# EAGLE design MainBoard (EAGLE 9.6.2)

## Sheet 1 of 2
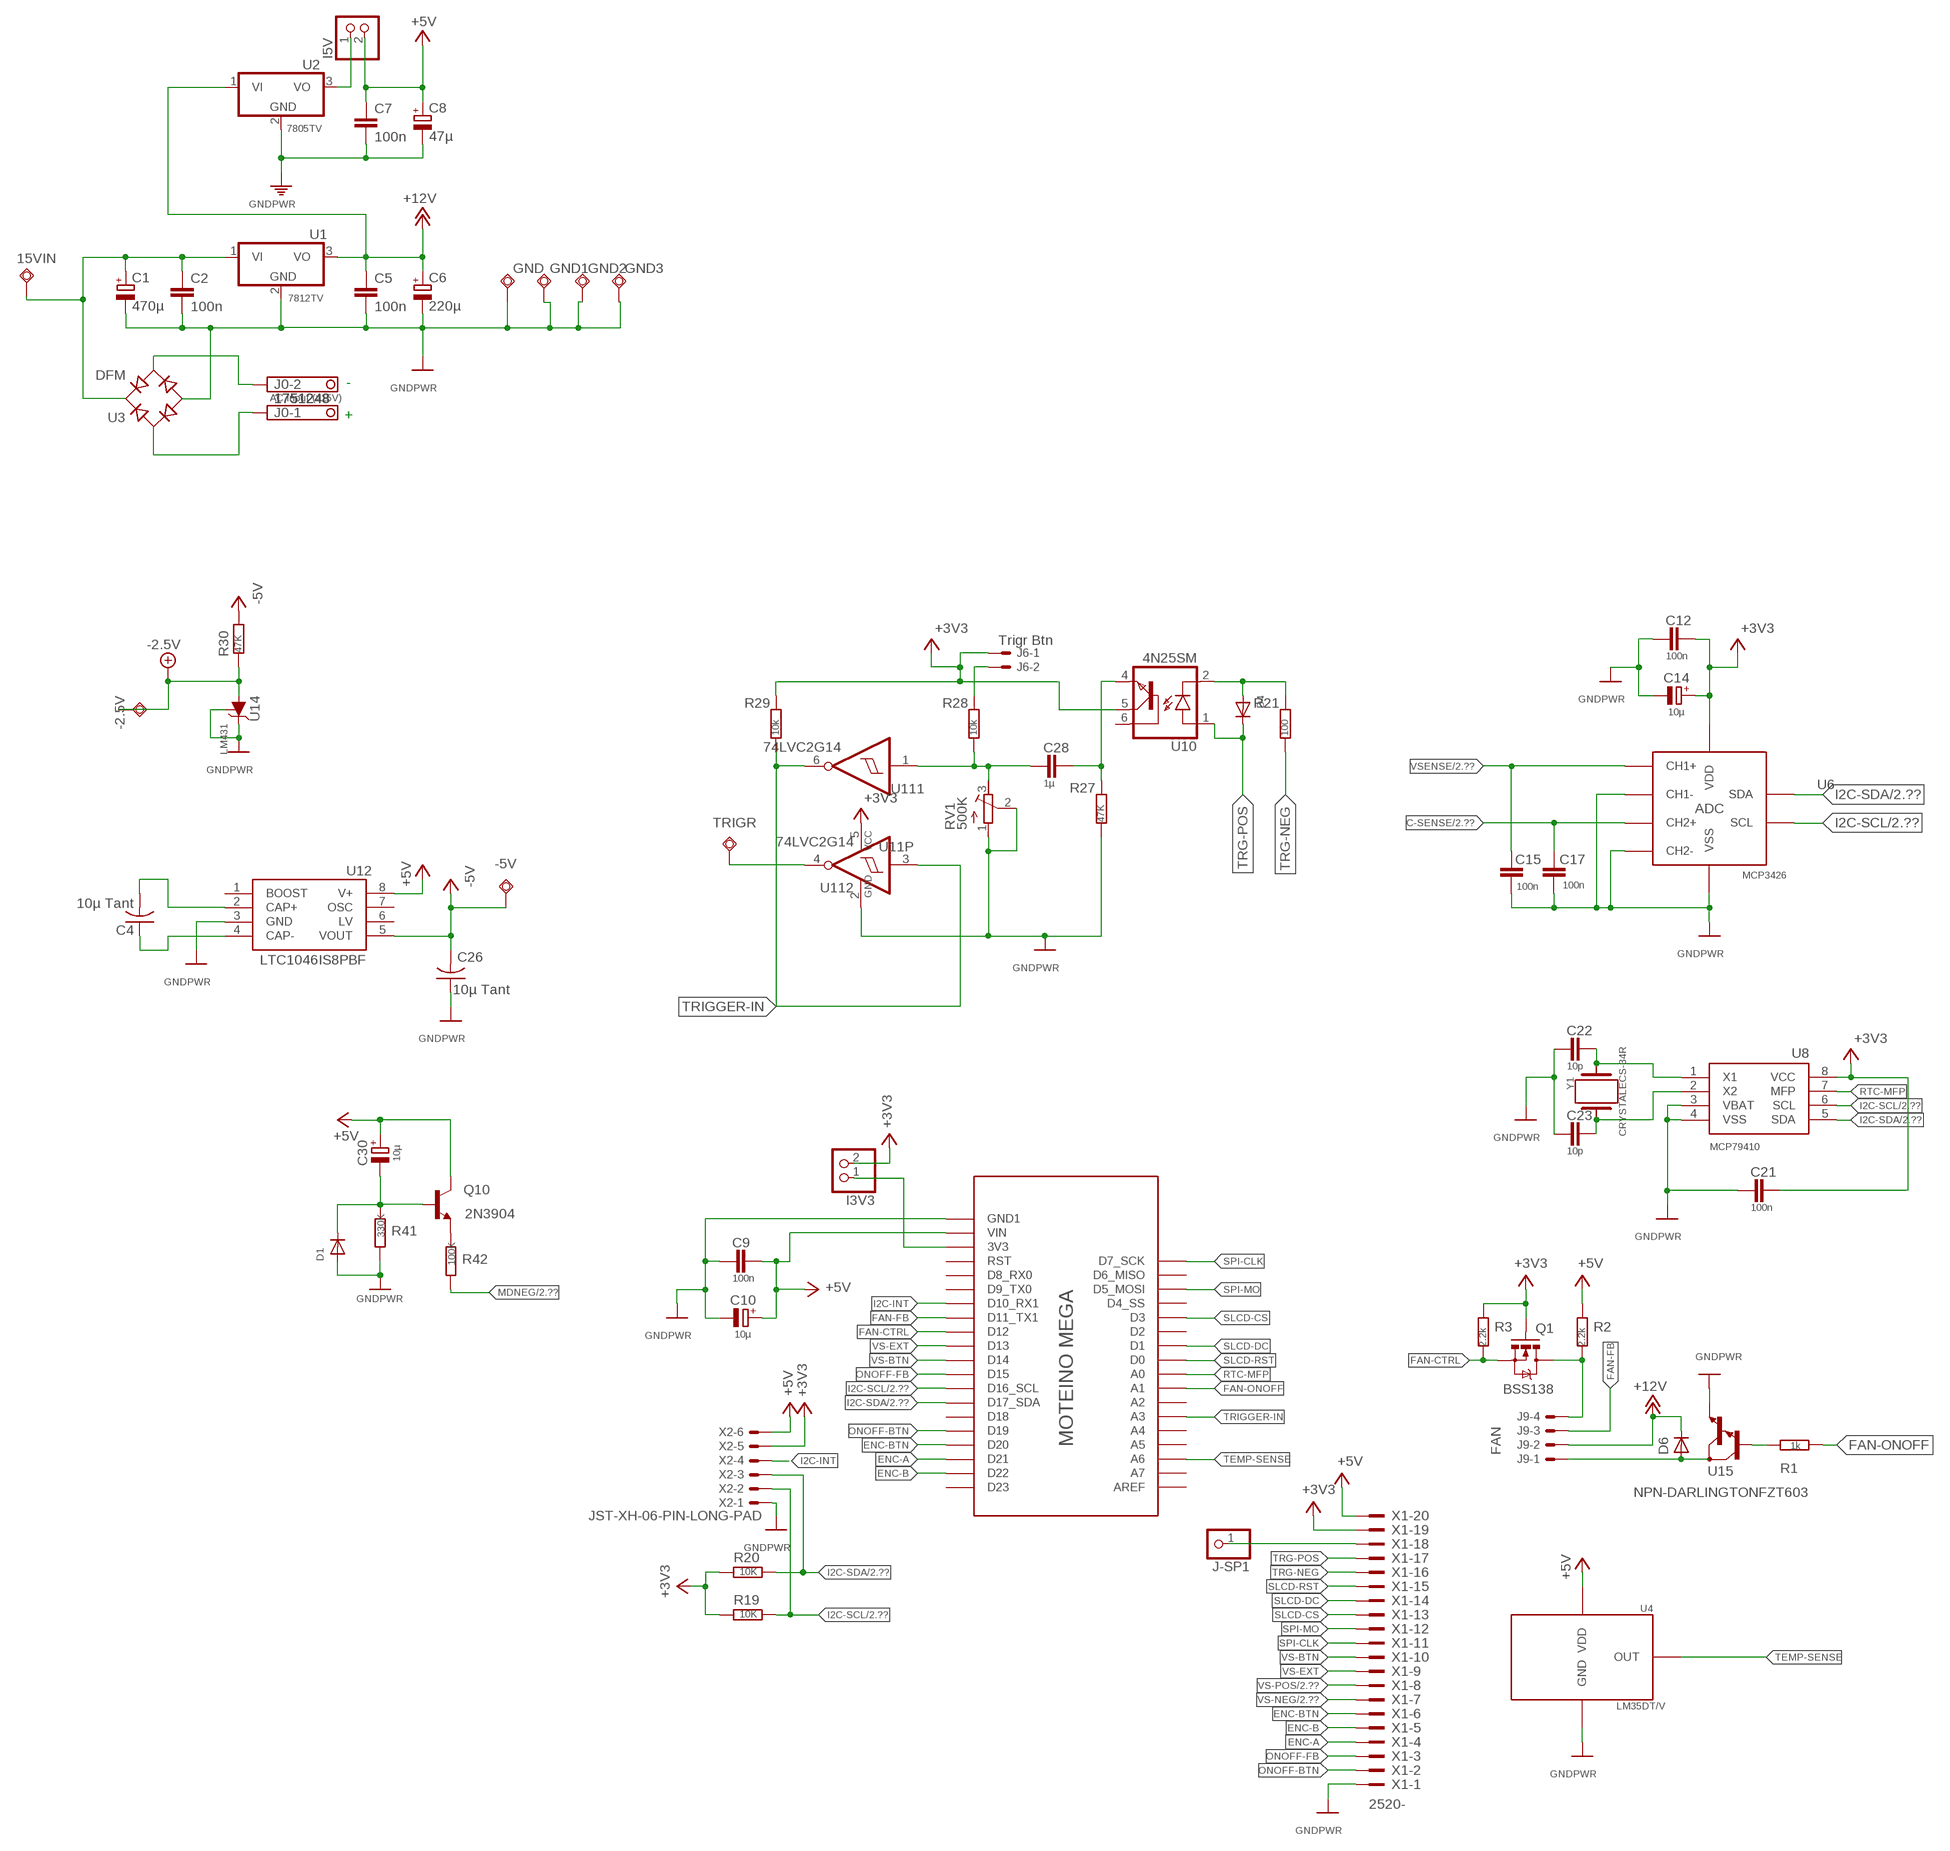
[diagram p0: schematic, sheet 1]

### Parts
15VIN  TEST-POINT4952  [TP-KEYSTONE-4952]
-2.5V  TEST-POINT4952  [TP-KEYSTONE-4952]
-5V  TEST-POINT4952  [TP-KEYSTONE-4952]
C1  470µ  CPOL-EUE5-10.5  [E5-10,5]
C2  100n  C-EUC0805K  [C0805K]
C4  10µ Tant  C-USC1210  [C1210]
C5  100n  C-EUC0805K  [C0805K]
C6  220µ  CPOL-EUE5-10.5  [E5-10,5]
C7  100n  C-EUC0805K  [C0805K]
C8  47µ  CPOL-EUE5-5  [E5-5]
C9  100n  C-EUC0805K  [C0805K]
C10  10µ  CPOL-EUE2-5  [E2-5]
C12  100n  C-EUC0805K  [C0805K]
C14  10µ  CPOL-EUE2-5  [E2-5]
C15  100n  C-EUC0805K  [C0805K]
C17  100n  C-EUC0805K  [C0805K]
C21  100n  C-EUC0805K  [C0805K]
C22  10p  C-EUC0805K  [C0805K]
C23  10p  C-EUC0805K  [C0805K]
C26  10µ Tant  C-USC1210  [C1210]
C28  1µ  C-EUC0805K  [C0805K]
C30  10µ  CPOL-EUE2-5  [E2-5]
D1  DIODESOD-323F  [SOD-323F]
D4  DIODESOD-323F  [SOD-323F]
D6  DIODE_SOD-123FL  [SOD-123FL]
GND  TEST-POINT4952  [TP-KEYSTONE-4952]
GND1  TEST-POINT4952  [TP-KEYSTONE-4952]
GND2  TEST-POINT4952  [TP-KEYSTONE-4952]
GND3  TEST-POINT4952  [TP-KEYSTONE-4952]
I3V3  PINHD-1X2  [1X02]
I5V  PINHD-1X2  [1X02]
J0  1751248  [1751248]
J6  Trigr Btn  JST-XH-02-PIN-ROUND-PAD  [JST-XH-02-PACKAGE-ROUND-PAD]
J9  FAN  JST-XH-04-PIN-ROUND-PAD  [JST-XH-04-PACKAGE-ROUND-PAD]
J-SP1  PINHD-1X1  [1X01]
Q1  BSS138  MOSFET-NCHANNELBSS138  [SOT23]
Q10  2N3904  [TO92]
R1  1k  R-EU_R0805  [R0805]
R2  2.2k  R-EU_R0805  [R0805]
R3  2.2k  R-EU_R0805  [R0805]
R19  10K  R-EU_R0805  [R0805]
R20  10K  R-EU_R0805  [R0805]
R21  100  R-EU_R0805  [R0805]
R27  47K  R-EU_R0805  [R0805]
R28  10k  R-EU_R0805  [R0805]
R29  10k  R-EU_R0805  [R0805]
R30  47K  R-EU_R0805  [R0805]
R41  330K  R-EU_R0805  [R0805]
R42  100K  R-EU_R0805  [R0805]
RV1  500K  R-TRIMM3296W  [RTRIM3296W]
TRIGR  TEST-POINT4952  [TP-KEYSTONE-4952]
U1  7812TV  [TO220V]
U2  7805TV  [TO220V]
U3  DFM  [DFM]
U4  LM35DT/V  [TO220V]
U6  MCP3426  [SO8]
U8  MCP79410  MCP79410-I_SN  [SOIC127P600X175-8N]
U10  4N25SM  [DIL6-SMD]
U11  74LVC2G14  [SOT23-6]
U12  LTC1046IS8PBF  [SOIC127P599X175-8N]
U14  LM431  [SOT23]
U15  NPN-DARLINGTONFZT603  [SOT223]
U$1  MOTEINO_MEGA_SIMPLE  [MOTEINO_MEGA_SIMPLE]
X1  2520-  [PAK100/2500-20]
X2  JST-XH-06-PIN-LONG-PAD  [JST-XH-06-PACKAGE-LONG-PAD]
Y1  CRYSTALECS-34R  [ECS32712534RRTR]

### Nets
+3V3: C12.1 C14.+ C21.1 I3V3.2 J6.1 Q1.1(G) R3.2 R19.2 R20.2 R29.2 U6.3(VDD) U8.8(VCC) U10.5(COL) U11.5(P:VCC) X1.19 X2.5
+5V: C7.1 C8.+ C9.1 C10.+ C30.+ I5V.2 Q10.1(C) R2.2 U4.1(VDD) U12.8(V+) U$1.VIN U$1.VIN_2(VIN) X1.20 X2.6 ; also sheet 2
+12V [Fan]: C5.1 C6.+ D6.C J9.2 U1.3(VO) U2.1(VI)
-2.5V: -2.5V.P$1(TP) R30.1 U14.3(A) ; also sheet 2
-5V: -5V.P$1(TP) C26.2 R30.2 U12.5(VOUT) ; also sheet 2
C-SENSE: C17.2 U6.7(CH2+) ; also sheet 2
ENC-A: U$1.D21 X1.4
ENC-B: U$1.D22 X1.5
ENC-BTN: U$1.D20 X1.6
FAN-CTRL: Q1.2(S) R3.1 U$1.D12
FAN-CTRL-5V: J9.4 Q1.3(D) R2.1
FAN-FB: J9.3 U$1.D11(D11_TX1)
FAN-ONOFF: R1.1 U$1.A1
GND: C1.- C2.2 C5.2 C6.- C7.2 C8.- C9.2 C10.- C12.2 C14.- C15.2 C17.1 C21.2 C22.2 C23.2 C26.1 D1.A GND1.P$1(TP) GND2.P$1(TP) GND3.P$1(TP) GND.P$1(TP) R27.1 R41.2 RV1.1(A) RV1.2(S) U1.2(GND) U2.2(GND) U3.- U4.2(GND) U6.2(CH1-) U6.6(VSS) U6.8(CH2-) U8.3(VBAT) U8.4(VSS) U11.2(P:GND) U12.3(GND) U14.1(C) U14.2(ADJ) U15.3(E) U$1.GND1 U$1.GND_2(GND1) X1.1 X2.1 ; supply symbol labelled GNDPWR ; also sheet 2
I2C-INT: U$1.D10(D10_RX1) X2.4
I2C-SCL: R19.1 U6.5(SCL) U8.6(SCL) U$1.D16(D16_SCL) X2.2 ; also sheet 2
I2C-SDA: R20.1 U6.4(SDA) U8.5(SDA) U$1.D17(D17_SDA) X2.3 ; also sheet 2
MDNEG: R42.2 ; also sheet 2
N$1: TRIGR.P$1(TP) U11.4(2:O)
N$2: D6.A J9.1 U15.2(C) U15.4(C)
N$3: I5V.1 U2.3(VO)
N$4: I3V3.1 U$1.3V3 U$1.3V3_2(3V3)
N$5: 15VIN.P$1(TP) C1.+ C2.1 U1.1(VI) U3.+
N$6: J0.1 U3.A1(AC1)
N$9: J0.2 U3.A2(AC2)
N$22: C4.2 U12.2(CAP+)
N$23: J-SP1.1 X1.18
N$24: C4.1 U12.4(CAP-)
N$27: C28.2 R28.1 RV1.3(E) U11.1(1:I)
N$28: C28.1 R27.2 U10.4(EMI)
N$29: D4.A R21.2 U10.2(C)
N$35: J6.2 R28.2
N$62: Q10.3(E) R42.1
N$63: C30.- D1.C Q10.2(B) R41.1
ONOFF-BTN: U$1.D19 X1.2
ONOFF-FB: U$1.D15 X1.3
RTC-MFP: U8.7(MFP) U$1.A0
RTCX1: C22.1 U8.1(X1) Y1.1
RTCX2: C23.1 U8.2(X2) Y1.2
SLCD-CS: U$1.D3 X1.13
SLCD-DC: U$1.D1 X1.14
SLCD-RST: U$1.D0 X1.15
SPI-CLK: U$1.D7(D7_SCK) X1.11
SPI-MO: U$1.D5(D5_MOSI) X1.12
TEMP-SENSE: U4.3(OUT) U$1.A6
TRG-NEG: R21.1 X1.16
TRG-POS: D4.C U10.1(A) X1.17
TRIGGER-IN: R29.1 U11.3(2:I) U11.6(1:O) U$1.A3
U15IN: R1.2 U15.1(B)
VS-BTN: U$1.D14 X1.10
VS-EXT: U$1.D13 X1.9
VS-NEG: X1.7 ; also sheet 2
VS-POS: X1.8 ; also sheet 2
VSENSE: C15.1 U6.1(CH1+) ; also sheet 2
Unconnected: U10.6(BAS) U12.1(BOOST) U12.6(LV) U12.7(OSC) U$1.A2 U$1.A4 U$1.A5 U$1.A7 U$1.AREF U$1.D2 U$1.D4(D4_SS) U$1.D6(D6_MISO) U$1.D8(D8_RX0) U$1.D9(D9_TX0) U$1.D18 U$1.D23 U$1.RST

### Notes on the sheet
- -
- AC Input (>15V)
- +

## Sheet 2 of 2
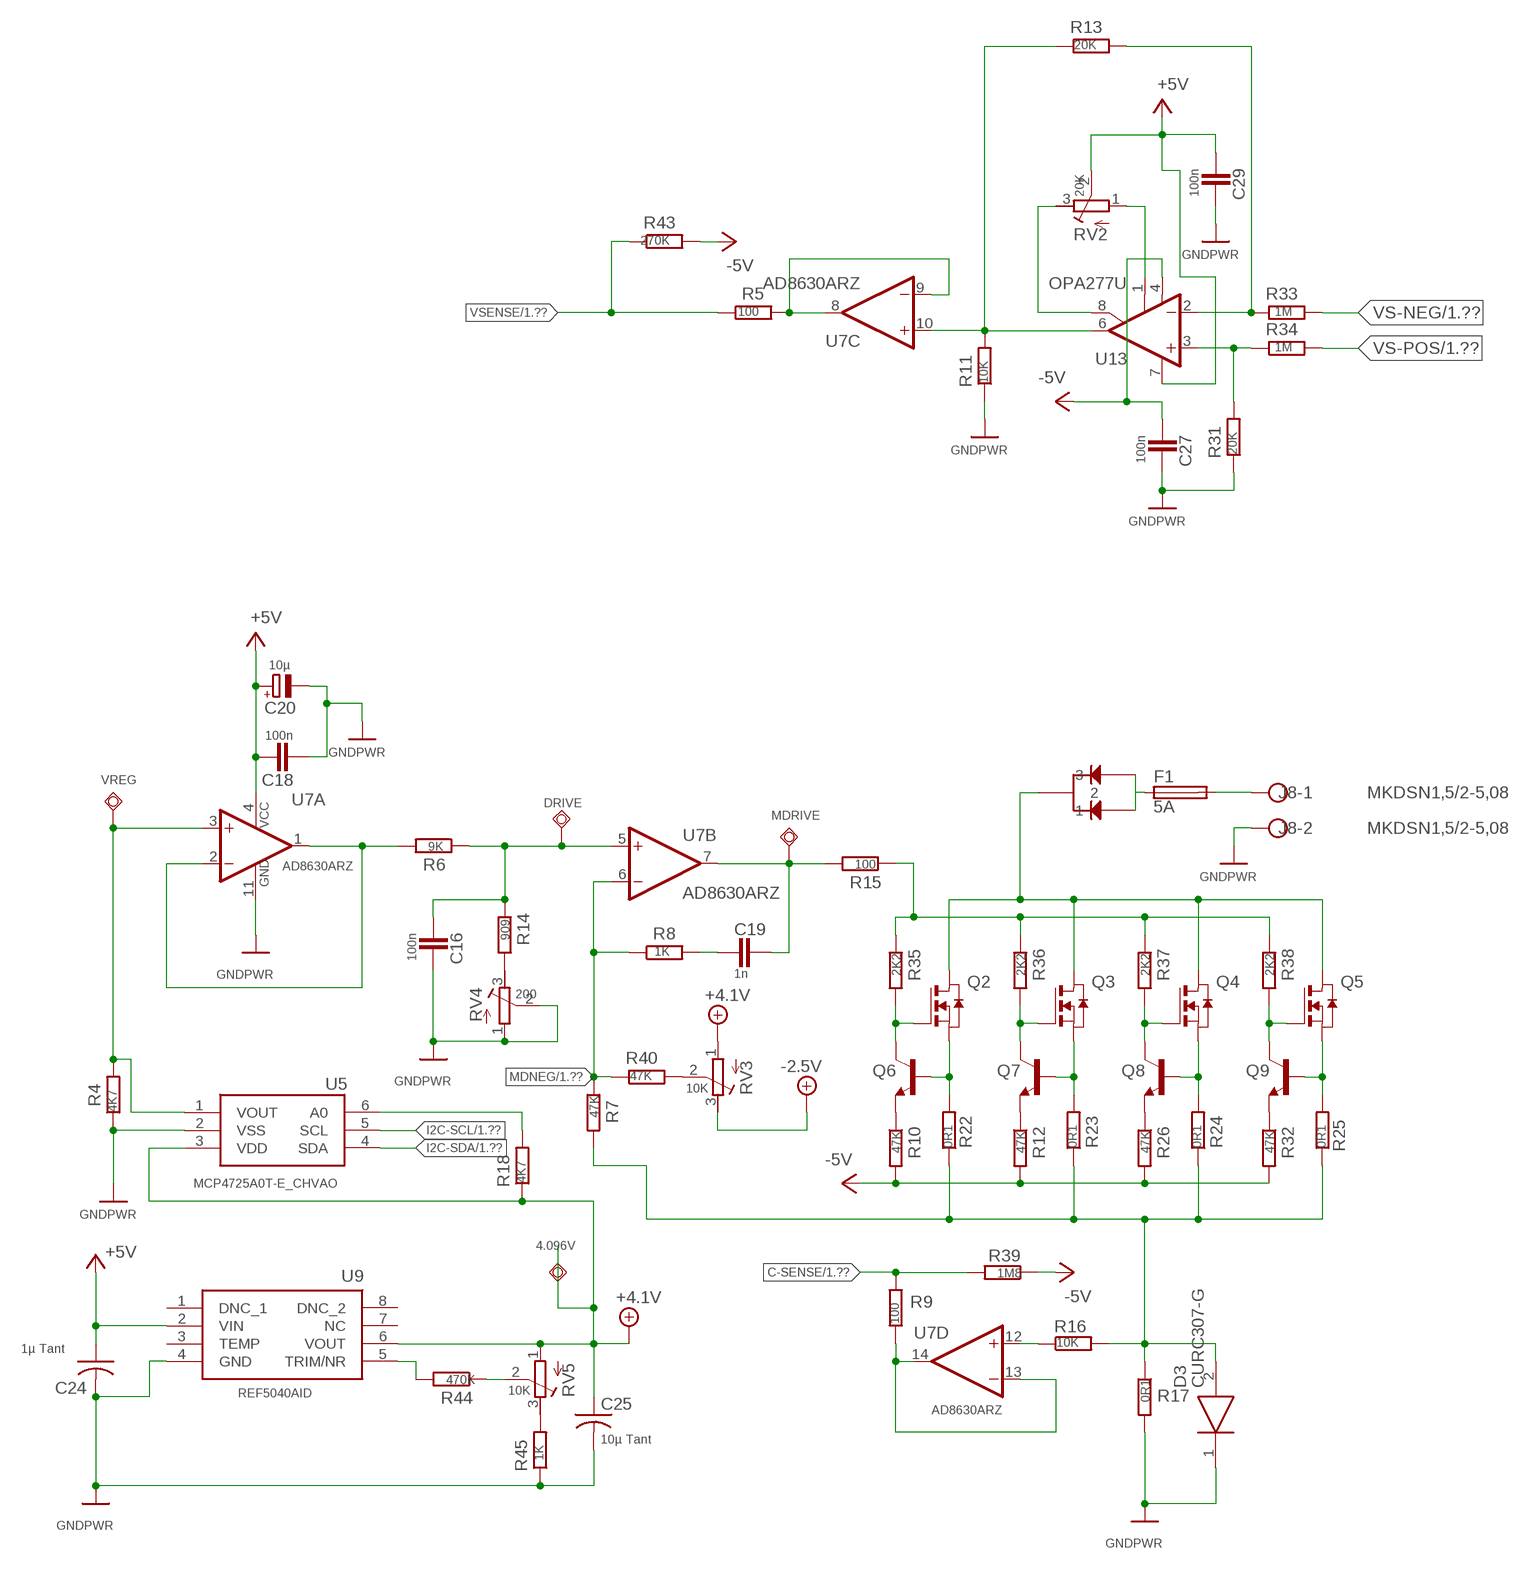
[diagram p1: schematic, sheet 2]

### Parts
4.096V  TEST-POINT4952  [TP-KEYSTONE-4952]
C16  100n  C-EUC0805K  [C0805K]
C18  100n  C-EUC0805K  [C0805K]
C19  1n  C-EUC0805K  [C0805K]
C20  10µ  CPOL-EUE2-5  [E2-5]
C24  1µ Tant  C-USC1210  [C1210]
C25  10µ Tant  C-USC1210  [C1210]
C27  100n  C-EUC0805K  [C0805K]
C29  100n  C-EUC0805K  [C0805K]
D3  CURC307-G  [DIOM7959X262N]
D5  MBR41H100CT/V  [TO220-VERT]
DRIVE  TEST-POINT4952  [TP-KEYSTONE-4952]
F1  5A  SHK20L  [SHK20L]
J8  MKDSN1,5/2-5,08  [MKDSN1,5/2-5,08]
MDRIVE  TEST-POINT4952  [TP-KEYSTONE-4952]
Q2  SUP70040E/V  [TO220-VERT]
Q3  SUP70040E/V  [TO220-VERT]
Q4  SUP70040E/V  [TO220-VERT]
Q5  SUP70040E/V  [TO220-VERT]
Q6  MPS2222A-NPN-TO92-CBE  [TO92-CBE]
Q7  MPS2222A-NPN-TO92-CBE  [TO92-CBE]
Q8  MPS2222A-NPN-TO92-CBE  [TO92-CBE]
Q9  MPS2222A-NPN-TO92-CBE  [TO92-CBE]
R4  4K7  R-EU_R0805  [R0805]
R5  100  R-EU_R0805  [R0805]
R6  9K  R-EU_R0805  [R0805]
R7  47K  R-EU_R0805  [R0805]
R8  1K  R-EU_R0805  [R0805]
R9  100  R-EU_R0805  [R0805]
R10  47K  R-EU_R0805  [R0805]
R11  10K  R-EU_R0805  [R0805]
R12  47K  R-EU_R0805  [R0805]
R13  20K  R-EU_R1206  [R1206]
R14  909  R-EU_R1206  [R1206]
R15  100  R-EU_R0805  [R0805]
R16  10K  R-EU_R0805  [R0805]
R17  0R1  PWR220T-35  [TO220-DPAC]
R18  4K7  R-EU_R0805  [R0805]
R22  0R1  RESISTOR0750V  [0750V]
R23  0R1  RESISTOR0750V  [0750V]
R24  0R1  RESISTOR0750V  [0750V]
R25  0R1  RESISTOR0750V  [0750V]
R26  47K  R-EU_R0805  [R0805]
R31  20K  R-EU_R1206  [R1206]
R32  47K  R-EU_R0805  [R0805]
R33  1M  R-EU_R1206  [R1206]
R34  1M  R-EU_R1206  [R1206]
R35  2K2  R-EU_R0805  [R0805]
R36  2K2  R-EU_R0805  [R0805]
R37  2K2  R-EU_R0805  [R0805]
R38  2K2  R-EU_R0805  [R0805]
R39  1M8  R-EU_R0805  [R0805]
R40  47K  R-EU_R1206  [R1206]
R43  270K  R-EU_R0805  [R0805]
R44  470K  R-EU_R0805  [R0805]
R45  1K  R-EU_R0805  [R0805]
RV2  20K  R-TRIMM3296W  [RTRIM3296W]
RV3  10K  R-TRIMM3296W  [RTRIM3296W]
RV4  200  R-TRIMM3296W  [RTRIM3296W]
RV5  10K  R-TRIMM3296W  [RTRIM3296W]
U5  MCP4725A0T-E_CHVAO  [SOT95P270X145-6N]
U7  AD8630ARZ  [SO14]
U9  REF5040AID  [SOIC127P600X175-8N]
U13  OPA277U  [SO08]
VREG  TEST-POINT4952  [TP-KEYSTONE-4952]

### Nets
+4.1V: 4.096V.P$1(TP) C25.1 R18.1 RV3.1(A) RV5.1(A) U5.3(VDD) U9.6(VOUT)
+5V: C18.1 C20.+ C24.1 C29.2 RV2.2(S) U7.4(P:VCC) U9.2(VIN) U13.7(V+) ; also sheet 1
-2.5V: RV3.3(E) ; also sheet 1
-5V: C27.2 R10.2 R12.2 R26.2 R32.2 R39.1 R43.2 U13.4(V-) ; also sheet 1
C-SENSE: R9.2 R39.2 ; also sheet 1
DACA0: R18.2 U5.6(A0)
DACVO: R4.2 U5.1(VOUT) U7.3(A:+IN) VREG.P$1(TP)
GND: C16.1 C18.2 C20.- C24.2 C25.2 C27.1 C29.1 D3.1(K) J8.2 R4.1 R11.1 R17.2 R31.1 R45.1 RV4.1(A) RV4.2(S) U5.2(VSS) U7.11(P:GND) U9.4(GND) ; supply symbol labelled GNDPWR ; also sheet 1
I2C-SCL: U5.5(SCL) ; also sheet 1
I2C-SDA: U5.4(SDA) ; also sheet 1
MDNEG: R7.1 R8.1 R40.1 U7.6(B:-IN) ; also sheet 1
N$7: R44.2 U9.5(TRIM/NR)
N$10: R45.2 RV5.3(E)
N$11: R44.1 RV5.2(S)
N$13: R6.2 U7.1(A:OUT) U7.2(A:-IN)
N$14: C16.2 DRIVE.P$1(TP) R6.1 R14.1 U7.5(B:+IN)
N$21: R13.2 R33.1 U13.2(-IN)
N$26: R14.2 RV4.3(E)
N$32: C19.1 MDRIVE.P$1(TP) R15.2 U7.7(B:OUT)
N$33: Q2.1(G) Q6.C R35.2
N$34: C19.2 R8.2
N$36: Q3.1(G) Q7.C R36.2
N$37: Q4.1(G) Q8.C R37.2
N$38: Q5.1(G) Q9.C R38.2
N$39: R15.1 R35.1 R36.1 R37.1 R38.1
N$40: Q6.E R10.1
N$41: Q7.E R12.1
N$42: Q8.E R26.1
N$43: Q2.3(S) Q6.B R22.2
N$44: Q9.E R32.1
N$45: Q3.3(S) Q7.B R23.2
N$46: Q4.3(S) Q8.B R24.2
N$47: Q5.3(S) Q9.B R25.2
N$48: R40.2 RV3.2(S)
N$49: D3.2(A) R7.2 R16.2 R17.1 R22.1 R23.1 R24.1 R25.1
N$50: D5.2 Q2.2(D) Q3.2(D) Q4.2(D) Q5.2(D)
N$51: R16.1 U7.12(D:+IN)
N$52: R9.1 U7.13(D:-IN) U7.14(D:OUT)
N$53: D5.1 D5.3 F1.1A F1.1B
N$54 [HightCurrent]: F1.2A F1.2B J8.1
N$55: R31.2 R34.1 U13.3(+IN)
N$58: RV2.3(E) U13.8(CMP2)
N$59: RV2.1(A) U13.1(CMP1)
N$60: R5.2 U7.8(C:OUT) U7.9(C:-IN)
U13-O: R11.2 R13.1 U7.10(C:+IN) U13.6(OUT)
VS-NEG: R33.2 ; also sheet 1
VS-POS: R34.2 ; also sheet 1
VSENSE: R5.1 R43.1 ; also sheet 1
Unconnected: U9.1(DNC_1) U9.3(TEMP) U9.7(NC) U9.8(DNC_2)

## Library data of the parts
4.096V 15VIN -2.5V -5V DRIVE GND GND1-GND3 MDRIVE TRIGR VREG = VDS-Connectors:TEST-POINT
C1 C6 C8 C10 C14 C20 C30 = resistor:CPOL-EU: POLARIZED CAPACITOR, European symbol
C2 C5 C7 C9 C12 C15-C19 C21-C23 C27-C29 = resistor:C-EU: CAPACITOR, European symbol
C4 C24-C26 = adafruit:C-US: CAPACITOR, American symbol
D1 D4 D6 = adafruit:DIODE: Diode SMADIODE - SMA Surface Mount Package 20V 1A Schottky Diode Digikey: 641-1014-6-ND DO-1N4148 - Through Hole Small Current Diode SOD-123 20V 1 A (.5mV Vf) Schottky Diode - Digikey: MBRX120TPMSCT-ND SOD-323 10V 570mA (.38mV Vf, 3ns) Schottky Diode - Digikey: ZLLS410CT-ND SOD-523 30V 30mA Schottky Diode (RB751S-40TE61) - Digikey: RB751S-40TE61CT-ND SOT23-R/W - SOT23 Package (R = Solder Paste/Reflow Ovens, W = Hand-Soldering) BAT54Film 40V 300mA - Digikey: 497-7162-1-ND
D3 = SamacSys_Parts:CURC307-G: Rectifiers Ultra Fast Rec. Rect 1000V, 3A Source: Datasheet <https://eagle.componentsearchengine.com/Datasheets/1/CURC307-G.pdf>; ALLIED_NUMBER: 70426719; ALLIED_PRICE-STOCK: https://www.alliedelec.com/comchiptechnology-curc307-g/70426719/; DESCRIPTION: Rectifiers Ultra Fast Rec. Rect 1000V, 3A; HEIGHT: 2.62mm; MANUFACTURER_NAME: Comchip Technology; MANUFACTURER_PART_NUMBER: CURC307-G; MOUSER_PART_NUMBER: 750-CURC307-G; MOUSER_PRICE-STOCK: https://www.mouser.co.uk/ProductDetail/Comchip-Technology/CURC307-G?qs=tw%252BuQ%2FB6PO29XOvegL4ZaQ%3D%3D
D5 = vdesmedt:MBR41H100CT
F1 = VDS-Power:SHK20L
I3V3 I5V = pinhead:PINHD-1X2: PIN HEADER
J0 = con-phoenix-350:1751248: MKDS 1/ 2-3,5 Printklemme Nennstrom: 10 A Bemessungsspannung: 160 V Raster: 3,5 mm Polzahl: 2 Montageart: Löten Anschlussart: Schraubanschluss Anschlussrichtung vom Leiter zur Platine: 0° Source: http://eshop.phoenixcontact.com .. 1751248.pdf; OC_FARNELL: unknown; OC_NEWARK: unknown
J6 = Rembrandt Electronics - JST XH Connectors v1-0:JST-XH-02-PIN: JST XH Connector 2 Pin Wire to board connector. Pitch: 2,54 mm, (0.100") Number of pins: 2 Created by Rembrandt Electronics www.rembrandtelectronics.com
J8 = con-phoenix-508:MKDSN1,5/2-5,08: MKDSN 1,5/ 2-5,08 Printklemme Nennstrom: 13,5 A Nennspannung: 250 V Rastermaß: 5,08 mm Polzahl: 2 Anschlussart: Schraubanschluss Montage: Löten Anschlussrichtung Leiter/Platine: 0 ° Artikelnummer: 1729128 Source: http://eshop.phoenixcontact.com .. 1729128.pdf
J9 = Rembrandt Electronics - JST XH Connectors v1-0:JST-XH-04-PIN: JST XH Connector 2 Pin Wire to board connector. Pitch: 2,54 mm, (0.100") Number of pins: 4 Created by Rembrandt Electronics www.rembrandtelectronics.com
J-SP1 = pinhead:PINHD-1X1: PIN HEADER
Q1 = BeagleBone_Blue_R3:MOSFET-NCHANNEL: Common NMOSFET Parts MFG P/N Store ID Prod ID FDD8780 TRANS-09984 SI7820DN TRANS-11055 FDS6630A IC-08089 2N7002PW TRANS-11151 FQP30N06L COM-10213 TRANS-10060 BSS123LT1G TRANS-08345 BSS138 TRANS-00830 BS170 2N7000; PROD_ID: TRANS-00830
Q2-Q5 = vdesmedt:SUP70040E
Q6-Q9 = transistor:*-NPN-: NPN Transistror BF959 corrected 2008.03.06
Q10 = transistor:2N3904: NPN TRANSISTOR
R1-R16 R18-R21 R26-R45 = resistor:R-EU_: RESISTOR, European symbol
R17 = vdesmedt:PWR220T-35
R22-R25 = VDS-Basics:RESISTOR
RV1-RV5 = resistor:R-TRIMM: Trimm resistor
U1 U2 = linear:78*: Positive VOLTAGE REGULATOR Source: http://cache.national.com/ds/LM/LM78L05.pdf http://www.fairchildsemi.com/ds/LM/LM7805.pdf
U3 = VDS-Rectifiers:DF
U4 = VAS-Sensors:LM35DT
U5 = SamacSys_Parts:MCP4725A0T-E_CHVAO: Microchip Technology Automotive, Single, 12-Bit NV DAC with I2C interface Source: Datasheet <http://ww1.microchip.com/downloads/en/devicedoc/22039d.pdf>; DESCRIPTION: Microchip Technology Automotive, Single, 12-Bit NV DAC with I2C interface; HEIGHT: 1.45mm; MANUFACTURER_NAME: Microchip; MANUFACTURER_PART_NUMBER: MCP4725A0T-E/CHVAO; MOUSER_PART_NUMBER: 579-MCP4725A0TECHVAO; MOUSER_PRICE-STOCK: https://www.mouser.com/Search/Refine.aspx?Keyword=579-MCP4725A0TECHVAO
U6 = vdesmedt:MCP3426
U7 = vdesmedt:AD8630ARZ
U8 = SamacSys_Parts:MCP79410-I_SN: I2C GP RTCC, 1Kb EE, 64B SRAM, ID Source: Datasheet <http://ww1.microchip.com/downloads/en/DeviceDoc/20002266G.pdf>; ALLIED_NUMBER: 70047472; ALLIED_PRICE-STOCK: http://www.alliedelec.com/microchip-technology-inc-mcp79410-i-sn/70047472/; DESCRIPTION: I2C GP RTCC, 1Kb EE, 64B SRAM, ID; HEIGHT: 1.75mm; MANUFACTURER_NAME: Microchip; MANUFACTURER_PART_NUMBER: MCP79410-I/SN; MOUSER_PART_NUMBER: 579-MCP79410-I/SN; MOUSER_PRICE-STOCK: https://www.mouser.com/Search/Refine.aspx?Keyword=579-MCP79410-I%2FSN; RS_PART_NUMBER: 7263949P; RS_PRICE-STOCK: http://uk.rs-online.com/web/p/products/7263949P
U9 = SamacSys_Parts:REF5040AID: Low Noise, Very Low Drift, Precision Series Voltage Reference Source: Datasheet <http://www.ti.com/lit/ds/symlink/ref5040.pdf>; DESCRIPTION: Low Noise, Very Low Drift, Precision Series Voltage Reference; HEIGHT: 1.75mm; MANUFACTURER_NAME: Texas Instruments; MANUFACTURER_PART_NUMBER: REF5040AID; MOUSER_PART_NUMBER: 595-REF5040AID; MOUSER_PRICE-STOCK: https://www.mouser.com/Search/Refine.aspx?Keyword=595-REF5040AID; RS_PART_NUMBER: 0404326P; RS_PRICE-STOCK: http://uk.rs-online.com/web/p/products/0404326P
U10 = optocoupler:4N*?M: General Purpose 6-Pin Phototransistor Optocouplers Source: http://www.fairchildsemi.com/ds/4N/4N35-M.pdf; MF: FAIRCHILD SEMICONDUCTOR; MPN: 4N25SM; OC_FARNELL: 1021152; OC_NEWARK: 34C2020
U11 = vdesmedt:74LVC2G14
U12 = SamacSys_Parts:LTC1046IS8PBF: Inductorless 5V to -5V Converter Source: Datasheet <http://www.linear.com/docs/2898>; DESCRIPTION: Inductorless 5V to -5V Converter; HEIGHT: 1.752mm; MANUFACTURER_NAME: Linear Technology; MANUFACTURER_PART_NUMBER: LTC1046IS8PBF
U13 = linear:OPA277: High Precision OPERATIONAL AMPLIFIERS REPLACES OP-07, OP-77, OP-177 Source: opa277.pdf
U14 = vdesmedt:LM431
U15 = VDS-Basics:NPN-DARLINGTON
U$1 = Moteino:MOTEINO_MEGA_SIMPLE
X1 = con-3m:2520-: 3M (TM) Pak 100 4-Wall Header Source: 3M; OC_FARNELL: unknown; OC_NEWARK: unknown
X2 = Rembrandt Electronics - JST XH Connectors v1-0:JST-XH-06-PIN: JST XH Connector 2 Pin Wire to board connector. Pitch: 2,54 mm, (0.100") Number of pins: 6 Created by Rembrandt Electronics www.rembrandtelectronics.com
Y1 = vdesmedt:CRYSTAL

## Net classes
2 HightCurrent: clearance 0.406 mm

## Board
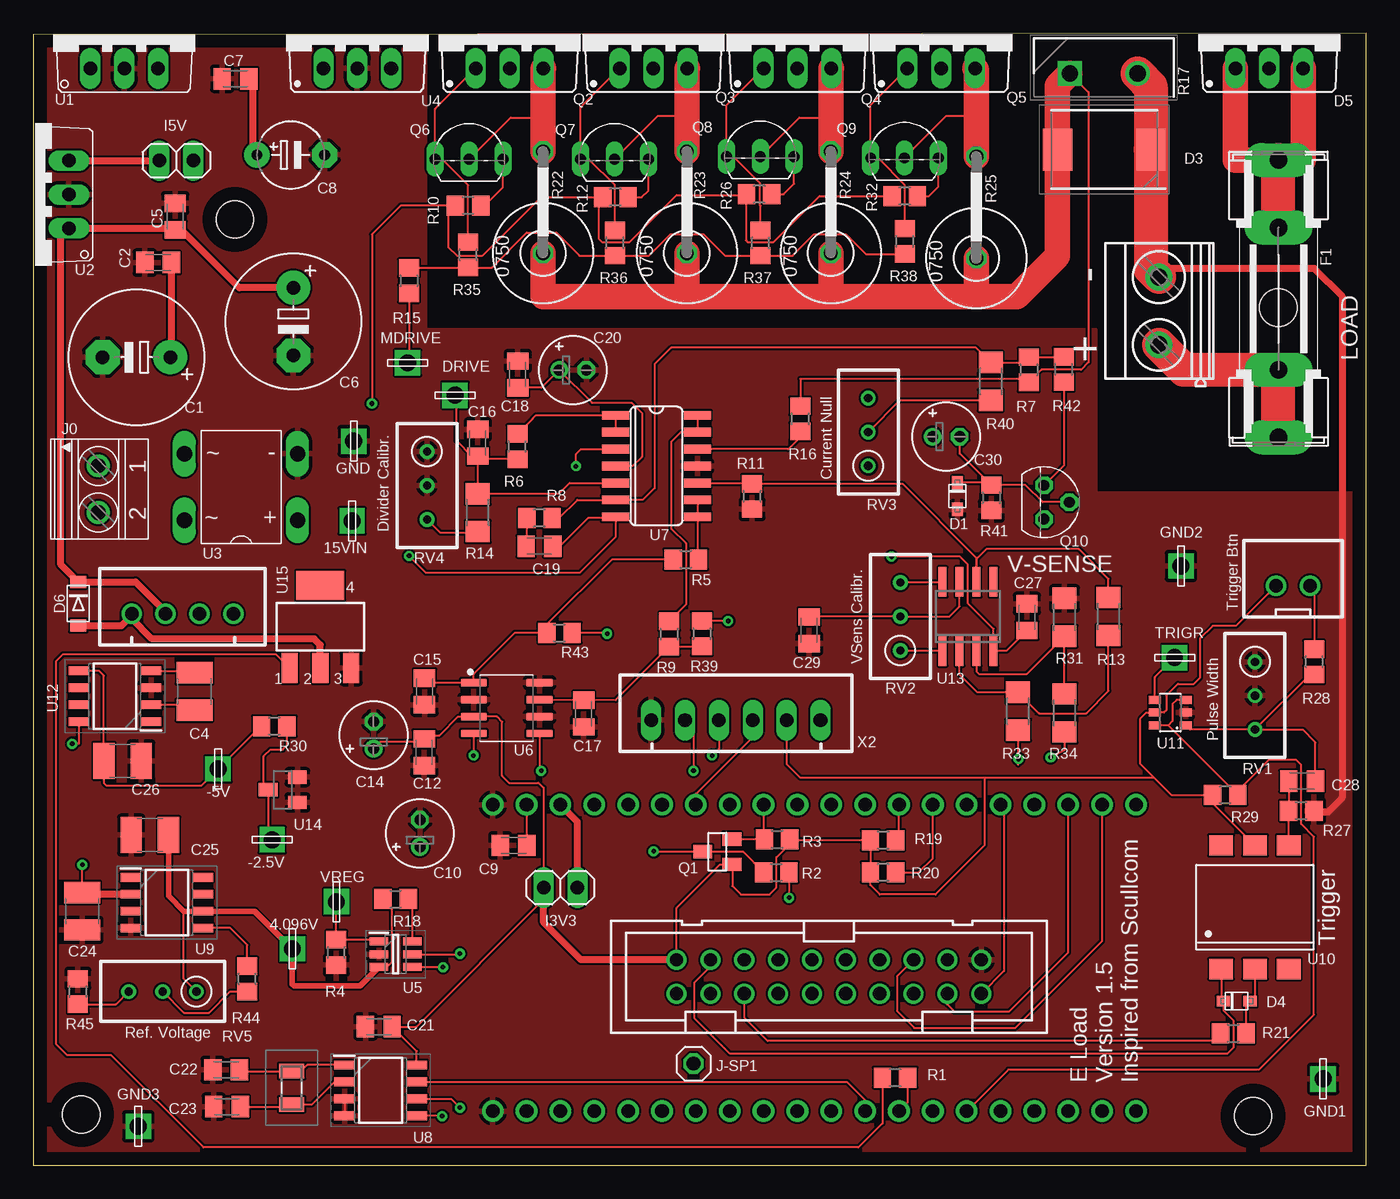
[diagram p2: board, top side]
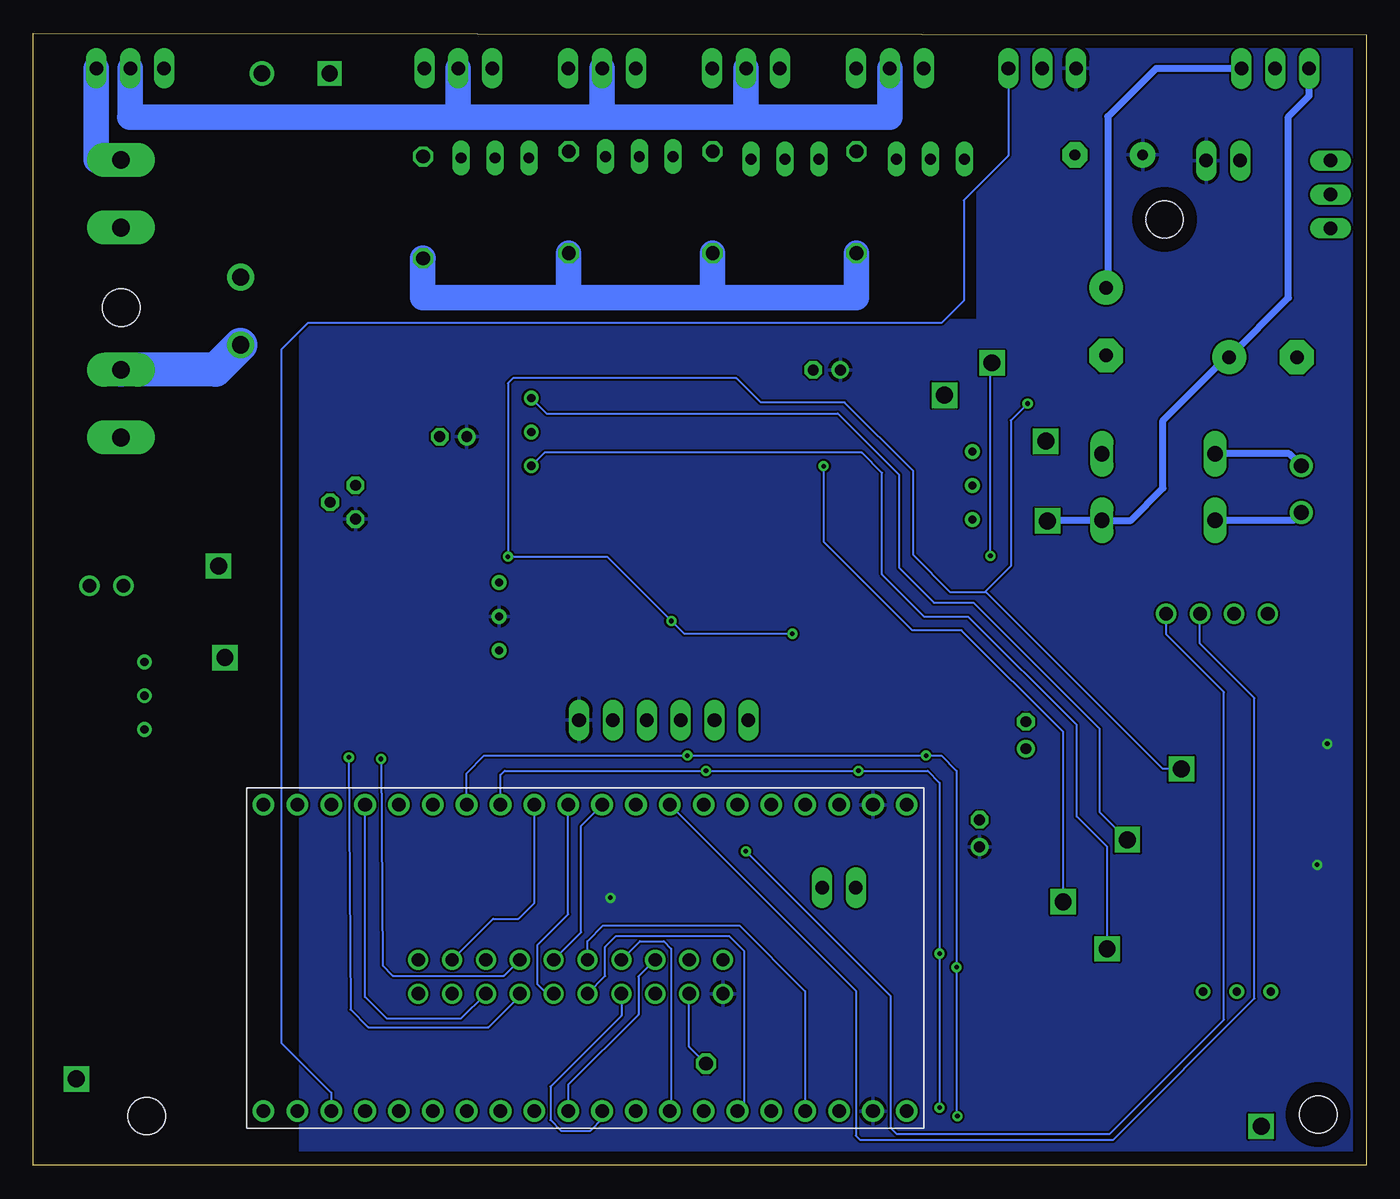
[diagram p3: board, bottom side, seen from below]

Size 100 x 84.93 mm. Coordinates in mm from the lower left corner, seen from the top.
Outline: 0,0 100,0 100,84.93 0,84.83 0,0
Copper layers (1*16): Top 0.035mm / dielectric 1.5mm / Bottom 0.035mm
Design rules "default *": minimum track width 6mil, minimum drill 0.35mm, track to track 6mil, track to pad 6mil, pad to pad 6mil, via to via 6mil, smd to smd 6mil, copper to edge 40mil, drill to drill 6mil, minimum pad ring 10mil, minimum via ring 8mil, stop-mask expansion 4mil, vias tented up to drill 0mil, thermal gap 10mil
Holes 2.8 mm at 93.4,64.34 15.12,70.97 91.5,3.7 3.6,3.8

### Footprints (pad centres in the part's own frame; a part is rotated, then mirrored left to right if it is on the bottom)
TP-KEYSTONE-4952 = drill 1.27 square: P$1 0,0
E5-10,5 = drill 1.016 pad 2.54: + -2.54,0 | drill 1.016 pad 2.54 octagon: - 2.54,0
C0805K = smd 1.3 x 1.6: 1 -1,0; 2 1,0
C1210 = smd 1.6 x 2.7: 1 -1.4,0; 2 1.4,0
E5-5 = drill 0.813 pad 1.905: + -2.54,0 | drill 0.813 pad 1.905 octagon: - 2.54,0
E2-5 = drill 0.813 pad 1.27: + -1.016,0 | drill 0.813 pad 1.27 octagon: - 1.016,0
SOD-323F = smd 1 x 0.8: A -1,0; C 1,0
DIOM7959X262N = smd 2.2 x 3.15: 1 -3.5,0; 2 3.5,0
TO220-VERT = drill 1.016 long: 1 -2.54,-2.54; 2 0,-2.54; 3 2.54,-2.54
SOD-123FL = smd 0.91 x 1.22: A 1.637,0; C -1.637,0
SHK20L = drill 1.321 pad 2.54 long: 1A -10.414,0; 1B -5.334,0; 2A 10.414,0; 2B 5.334,0
1X02 = drill 1.016 long: 1 -1.27,0; 2 1.27,0
1751248 = drill 1.1 pad 1.7: 1 -1.75,-0.1; 2 1.75,-0.1
JST-XH-02-PACKAGE-ROUND-PAD = drill 1.016: 1 -1.27,0; 2 1.27,0
MKDSN1,5/2-5,08 = drill 1.3 pad 2: 1 -2.561,0.025; 2 2.519,0.025
JST-XH-04-PACKAGE-ROUND-PAD = drill 1.016: 1 -3.81,0; 2 -1.27,0; 3 1.27,0; 4 3.81,0
1X01 = drill 1.016 octagon: 1 0,0
SOT23 = smd 1 x 1.4: 1 -0.95,-1.1; 2 0.95,-1.1; 3 0,1.1
TO92-CBE = drill 0.813 long: B 0,0; C -2.54,0; E 2.54,0
TO92 = drill 0.813 octagon: 1 1.27,0; 2 0,1.905; 3 -1.27,0
R0805 = smd 1.3 x 1.5: 1 -0.95,0; 2 0.95,0
R1206 = smd 1.6 x 1.803: 1 -1.422,0; 2 1.422,0
TO220-DPAC = drill 1.22 pad 1.83 square: 1 0,0 | drill 1.22 pad 1.83: 2 5.08,0
0750V = drill 1.016 octagon: 1 -5.08,0; 2 2.54,0
RTRIM3296W = drill 0.61: 1 0,-2.54; 2 0,0; 3 0,2.54
TO220V = drill 1.016 long: 1 -2.54,-2.54; 2 0,-2.54; 3 2.54,-2.54
DFM = drill 1.15 long: + 4.25,-2.5; - 4.25,2.5; A1 -4.25,2.5; A2 -4.25,-2.5
SOT95P270X145-6N = smd 1.4 x 0.6: 1 -1.25,0.95; 2 -1.25,0; 3 -1.25,-0.95; 4 1.25,-0.95; 5 1.25,0; 6 1.25,0.95
SO8 = smd 1.965 x 0.602: 1 -2.47,1.905; 2 -2.47,0.635; 3 -2.47,-0.635; 4 -2.47,-1.905; 5 2.47,-1.905; 6 2.47,-0.635; 7 2.47,0.635; 8 2.47,1.905
SO14 = smd 0.66 x 2.032: 1 -3.81,-3.073; 2 -2.54,-3.073; 3 -1.27,-3.073; 4 0,-3.073; 5 1.27,-3.073; 6 2.54,-3.073; 7 3.81,-3.073; 8 3.81,3.073; 9 2.54,3.073; 10 1.27,3.073; 11 0,3.073; 12 -1.27,3.073; 13 -2.54,3.073; 14 -3.81,3.073
SOIC127P600X175-8N = smd 1.525 x 0.65: 1 -2.712,1.905; 2 -2.712,0.635; 3 -2.712,-0.635; 4 -2.712,-1.905; 5 2.712,-1.905; 6 2.712,-0.635; 7 2.712,0.635; 8 2.712,1.905
DIL6-SMD = smd 1.78 x 1.52: 1 -2.54,-4.645; 2 0,-4.645; 3 2.54,-4.645; 4 2.54,4.645; 5 0,4.645; 6 -2.54,4.645
SOT23-6 = smd 0.6 x 0.9: 1 -0.95,-1.15; 2 0,-1.15; 3 0.95,-1.15; 4 0.95,1.15; 5 0,1.15; 6 -0.95,1.15
SOIC127P599X175-8N = smd 1.526 x 0.65: 1 -2.712,1.905; 2 -2.712,0.635; 3 -2.712,-0.635; 4 -2.712,-1.905; 5 2.712,-1.905; 6 2.712,-0.635; 7 2.712,0.635; 8 2.712,1.905
SO08 = smd 0.6 x 2.2: 1 -1.905,-2.6; 2 -0.635,-2.6; 3 0.635,-2.6; 4 1.905,-2.6; 5 1.905,2.6; 6 0.635,2.6; 7 -0.635,2.6; 8 -1.905,2.6
SOT223 = smd 1.219 x 2.235: 1 -2.311,-3.099; 2 0,-3.099; 3 2.311,-3.099 | smd 3.6 x 2.2: 4 0,3.099
MOTEINO_MEGA_SIMPLE = drill 1.016 pad 1.626: 3V3 6.35,24.257; 3V3_2 6.35,1.27; A0 29.21,24.257; A1 31.75,24.257; A2 34.29,24.257; A3 36.83,24.257; A4 39.37,24.257; A5 41.91,24.257; A6 44.45,24.257; A7 46.99,24.257; AREF 49.53,24.257; D0 26.67,24.257; D1 24.13,24.257; D2 21.59,24.257; D3 19.05,24.257; D4 16.51,24.257; D5 13.97,24.257; D6 11.43,24.257; D7 8.89,24.257; D8 11.43,1.27; D9 13.97,1.27; D10 16.51,1.27; D11 19.05,1.27; D12 21.59,1.27; D13 24.13,1.27; D14 26.67,1.27; D15 29.21,1.27; D16 31.75,1.27; D17 34.29,1.27; D18 36.83,1.27; D19 39.37,1.27; D20 41.91,1.27; D21 44.45,1.27; D22 46.99,1.27; D23 49.53,1.27; GND1 1.27,24.257; GND_2 1.27,1.27; RST 8.89,1.27; VIN 3.81,24.257; VIN_2 3.81,1.27
PAK100/2500-20 = drill 1 pad 1.422: 1 -11.43,-1.27; 2 -11.43,1.27; 3 -8.89,-1.27; 4 -8.89,1.27; 5 -6.35,-1.27; 6 -6.35,1.27; 7 -3.81,-1.27; 8 -3.81,1.27; 9 -1.27,-1.27; 10 -1.27,1.27; 11 1.27,-1.27; 12 1.27,1.27; 13 3.81,-1.27; 14 3.81,1.27; 15 6.35,-1.27; 16 6.35,1.27; 17 8.89,-1.27; 18 8.89,1.27; 19 11.43,-1.27; 20 11.43,1.27
JST-XH-06-PACKAGE-LONG-PAD = drill 1.016 long: 1 -6.35,0; 2 -3.81,0; 3 -1.27,0; 4 1.27,0; 5 3.81,0; 6 6.35,0
ECS32712534RRTR = smd 1.1 x 1.9: 1 -1.25,0; 2 1.25,0

### Placement (x,y rotation side)
4.096V  19.44,16.23 90 top
15VIN  23.91,48.34 90 top
-2.5V  17.92,24.42 180 top
-5V  13.86,29.73 270 top
C1  7.74,60.63 180 top
C2  9.36,67.73 180 top
C4  12.09,35.54 270 top
C5  10.65,71.17 90 top
C6  19.51,63.3 270 top
C7  15.17,81.51 180 top
C8  19.31,75.8 0 top
C9  36.03,24 180 top
C10  29.01,24.9 90 top
C12  29.33,30.98 270 top
C14  25.54,32.27 90 top
C15  29.35,35.55 270 top
C16  33.35,54.21 270 top
C17  41.3,33.89 90 top
C18  36.35,59.33 90 top
C19  37.97,46.44 180 top
C20  40.47,59.67 0 top
C21  25.92,10.4 180 top
C22  14.46,7.16 180 top
C23  14.53,4.4 180 top
C24  3.66,19.06 270 top
C25  8.74,24.77 180 top
C26  6.7,30.33 180 top
C27  74.54,41.12 270 top
C28  95.2,28.82 0 top
C29  58.21,40.14 90 top
C30  68.49,54.67 0 top
D1  69.33,50.2 90 top
D3  80.34,76.21 180 top
D4  90.29,12.3 180 top
D5  92.73,84.84 0 top
D6  3.38,42.13 270 top
DRIVE  31.63,57.78 0 top
F1  93.42,65.01 270 top
GND  24.04,54.33 90 top
GND1  96.77,6.48 90 top
GND2  86.11,44.96 90 top
GND3  7.87,2.92 90 top
I3V3  39.55,20.82 180 top
I5V  10.73,75.37 0 top
J0  4.97,50.72 270 top
J6  94.52,43.48 0 top
J8  84.47,64.12 90 top
J9  11.19,41.38 0 top
J-SP1  49.53,7.62 0 top
MDRIVE  28.07,60.2 180 top
Q1  51.32,23.52 90 top
Q2  35.73,84.84 0 top
Q3  46.53,84.84 0 top
Q4  57.32,84.84 0 top
Q5  68.12,84.84 0 top
Q6  32.7,75.49 0 top
Q7  43.6,75.49 0 top
Q8  54.54,75.68 0 top
Q9  65.36,75.58 0 top
Q10  75.83,49.74 270 top
R1  64.66,6.57 180 top
R2  55.75,21.97 0 top
R3  55.8,24.45 0 top
R4  22.74,15.96 90 top
R5  48.95,45.46 0 top
R6  36.31,53.92 90 top
R7  74.69,59.68 270 top
R8  37.97,48.55 180 top
R9  47.7,39.86 270 top
R10  32.62,71.99 180 top
R11  53.94,50.19 90 top
R12  43.67,72.63 180 top
R13  80.67,41.17 270 top
R14  33.35,48.97 270 top
R15  28.18,66.37 270 top
R16  57.55,56.01 90 top
R17  77.77,81.92 0 top
R18  27.18,19.97 0 top
R19  63.75,24.38 180 top
R20  63.75,21.97 180 top
R21  90.03,9.91 0 top
R22  38.24,73.51 90 top
R23  49.04,73.51 90 top
R24  59.83,73.51 90 top
R25  70.76,73.13 90 top
R26  54.46,72.85 180 top
R27  95.13,26.59 180 top
R28  96.1,37.77 90 top
R29  89.42,27.79 180 top
R30  18.08,32.93 180 top
R31  77.37,41.11 270 top
R32  65.38,72.72 180 top
R33  73.87,34.06 270 top
R34  77.37,33.93 270 top
R35  32.62,68.3 90 top
R36  43.64,69.19 90 top
R37  54.56,69.19 90 top
R38  65.39,69.32 90 top
R39  50.16,39.88 270 top
R40  71.84,58.81 270 top
R41  71.87,50.08 270 top
R42  77.3,59.71 90 top
R43  39.47,39.93 0 top
R44  16.05,13.98 90 top
R45  3.35,13.03 270 top
RV1  91.66,35.23 180 top
RV2  65.05,41.17 0 top
RV3  62.64,55.01 0 top
RV4  29.54,51 180 top
RV5  9.7,13.03 90 top
TRIGR  85.63,38.09 0 top
U1  6.83,84.82 0 top
U2  0.13,72.83 90 top
U3  15.58,50.89 0 top
U4  24.3,84.84 0 top
U5  27.18,15.84 0 top
U6  35.51,34.3 0 top
U7  46.74,52.46 270 top
U8  26.05,5.62 0 top
U9  10.01,19.7 0 top
U10  91.66,19.36 0 top
U11  85.31,33.96 90 top
U12  6.12,35.19 180 top
U13  70.13,41.17 0 top
U14  18.72,28.17 90 top
U15  21.54,40.4 0 top
U$1  33.2,28.32 180 bottom
VREG  22.74,19.77 90 top
X1  59.69,14.14 180 top
X2  52.7,33.4 0 top
Y1  19.38,5.81 270 top

### Tracks (layer width: path | path; a pad name or v marks a point on that pad's centre or on a via)
+3V3
  Top 0.152: U8.8 28.77,8.55 C21.1 28.74,10.4 38.28,19.94 I3V3.2 38.28,28.31 37.89,28.7 35.69,28.7 35.18,29.21 35.18,33.27 34.79,33.66 U6.3 31.89,33.66 30.48,32.26 29.61,32.26 C12.1 29.11,31.76 26.04,31.76 C14.+ | J6.1 90.23,40.47 88.48,40.47 87.53,39.52 87.53,36.56 87.09,36.12 85.88,36.12 84.99,35.23 84.99,34.12 84.83,33.96 U11.5 83.49,33.96 83.06,33.53 83.06,30.1 84.07,29.08 | U10.5 88.47,27.18 R29.2 85.37,27.79 84.07,29.08 | X1.19 48.26,19.3 51.52,22.57 Q1.1 52.45,22.54 52.45,20.95 53.09,20.32 55.24,20.32 55.75,20.83 55.75,23.11 56.79,24.16 56.79,24.41 | R3.2 56.79,24.41 | 71.37,29.08 71.37,24 67.69,20.32 63.5,20.32 62.8,21.02 R20.2 R19.2 62.78,24.41 56.79,24.41 | 71.37,29.08 84.07,29.08 | X2.5 56.52,30.1 57.53,29.08 71.37,29.08
  Top 0.508: X1.19 41.09,15.41 38.28,18.21 I3V3.2
+4.1V
  Top 0.152: U5.3 26.55,14.89 26.86,15.2 26.86,19.33 R18.1 | RV5.1 11.29,13.97 11.29,19.06
  Top 0.406: U5.3 24.5,13.46 19.56,13.46 19.44,13.59 4.096V.P$1 16.61,19.06 U9.6 11.29,19.06 10.14,20.21 C25.1
  Bottom 0.152: 4.096V.P$1 19.44,23.88 21.72,26.16 21.72,33.02 29.84,41.15 33.15,41.15 36.32,44.32 36.32,51.94 37.85,53.47 61.65,53.47 RV3.1
+5V  (via drill 0.35)
  Top 0.152: U9.2 | U7.4 44.97,52.46 45.66,53.15 45.66,56.45 44.9,57.21 41.91,57.21 C20.+ 38.12,58.33 C18.1 | U13.7 69.49,41.93 68.73,41.17 RV2.2 58.24,41.17 C29.2 | U$1.VIN_2 37.01,24 C9.1 | U12.8 3.41,31.62 v2.92,31.62 | C24.1 3.66,22.54 v3.68,22.54 | R2.2 56.7,20.07 v56.71,20.07
  Top 0.508: U9.2 3.79,20.33 C24.1 | C8.+ 16.51,76.07 16.51,81.17 C7.1
  pour Bottom: -1.27,86.36 -1.27,-1.27 80.01,-1.27 80.01,63.5 29.21,63.5 29.21,86.36
+12V
  Top 0.508: J9.2 9.92,41.51 7.67,43.77 D6.C 2.03,45.11 2.03,69.72 2.6,70.29 U2.1 10.53,70.29 C5.1 11.12,70.17 15.45,65.84 C6.+
  Bottom 0.508: C6.+ 19.38,65.97 19.38,78.67 15.78,82.28 U1.3
-2.5V
  Top 0.152: R30.1 19.03,31.5 18.71,31.19 17.79,31.19 17.3,30.7 17.3,28.49 U14.3 17.62,24.73 -2.5V.P$1
  Bottom 0.152: RV3.3 61.5,56.41 39.65,56.41 35.05,51.82 35.05,44.83 32.44,42.22 29.46,42.22 20.02,32.77 20.02,26.52 -2.5V.P$1
-5V  (via drill 0.35)
  Top 0.152: C27.2 73.02,38.6 72.05,38.6 72.05,38.58 U13.4 72.03,40.23 70.1,42.16 70.1,45.09 69.53,45.66 v64.39,45.66 | R30.2 17.06,32.93 -5V.P$1 12.64,28.51 5.46,28.51 5.3,28.68 C26.2 5.3,36.74 4.94,37.1 U12.5 | R32.2 58.99,72.72 55.53,69.26 53.59,69.26 53.46,69.4 53.46,72.8 R26.2 53.45,72.79 48.27,72.79 44.74,69.26 42.67,69.26 42.41,69.53 42.41,72.32 R12.2 38.1,72.63 33.72,68.25 31.78,68.25 31.14,68.89 31.14,71.46 R10.2 31.65,72.01 27.56,72.01 25.4,69.85 v25.4,57.15 | R43.2 43,39.93 v43.05,39.88 | v52.13,40.83 R39.1
  Bottom 0.152: -5V.P$1 15.26,29.73 28.51,42.99 28.64,42.99 | v25.4,57.15 26.67,55.88 26.67,44.96 28.64,42.99 | 28.64,42.99 31.18,42.99 33.98,45.8 33.98,52.07 39.14,57.22 45.41,57.22 47.24,59.05 64.01,59.05 64.39,58.67 v64.39,45.66 56.96,45.66 v52.13,40.83 51.18,39.88 v43.05,39.88
C-SENSE
  Top 0.152: R39.2 50.14,38.91 R9.2 43.69,34.9 C17.2 38.01,34.9 U6.7
DACA0
  Top 0.152: R18.2 28.43,19.67 U5.6
DACVO  (via drill 0.35)
  Top 0.152: U5.1 25.8,16.91 R4.2 VREG.P$1 | v40.7,52.45 40.7,53.34 41.09,53.73 U7.3
  Bottom 0.152: VREG.P$1 22.73,32.51 30.35,40.13 34.04,40.13 40.7,46.8 v40.7,52.45
ENC-A
  Top 0.152: X1.4 68.58,12.05 69.1,11.54 73.23,11.54 77.65,15.96 U$1.D21
ENC-B
  Top 0.152: X1.5 64.8,14.17 64.8,11.6 66.1,10.3 73.67,10.3 80.19,16.82 U$1.D22
ENC-BTN
  Bottom 0.152: X1.6 67.93,10.99 73.47,10.99 75.11,12.62 U$1.D20
FAN-CTRL
  Top 0.152: U$1.D12 54.79,24.52 | 54.79,24.52 R3.1 | Q1.2 54.74,24.47 54.79,24.52
FAN-CTRL-5V  (via drill 0.35)
  Top 0.152: R2.1 53.27,23.5 50.24,23.5 Q1.3 46.59,23.52 v46.55,23.56
  Bottom 0.152: v46.55,23.56 35.69,12.7 35.69,2.79 35.24,2.35 19.24,2.35 10.67,10.92 10.67,35.5 15,39.83 J9.4
FAN-FB
  Bottom 0.152: U$1.D11 38.29,13.09 38.29,2.22 37.97,1.91 18.99,1.91 8.38,12.51 8.38,35.05 12.46,39.13 J9.3
FAN-ONOFF
  Top 0.152: U$1.A1 65.61,4.72 R1.1
GND
  Top 0.152: U8.3 U8.4
  Top 0.508: R27.1 96.19,26.48 97.12,26.48 98.19,27.55 98.19,65.21 96.11,67.29 85.09,67.29 J8.2
  Top 2.54: R17.2 83.84,80.93 D3.1 83.84,67.24 J8.2
  pour Top: -0.36,-0.2 100.4,-0.2 100.4,50.4 79.66,50.34 79.66,62.66 29.35,62.62 29.35,85.37 -0.36,85.48
I2C-INT
  Top 0.152: U$1.D10 49.71,27.86 53.98,32.13 X2.4
I2C-SCL  (via drill 0.35)
  Top 0.152: v32,4.32 31.37,4.95 28.8,4.95 U8.6 | U6.5 37.98,29.71 v38.1,29.59 | U5.5 31.97,15.84 v32,15.88 | R19.1 64.95,24.63 U$1.D16 | v49.53,29.59 49.53,32.77 X2.2
  Bottom 0.152: U$1.D16 64.95,29.29 64.64,29.59 v49.53,29.59 v38.1,29.59 32.89,29.59 32,28.7 v32,15.88 v32,4.32
I2C-SDA  (via drill 0.35)
  Top 0.152: v30.67,3.68 30.2,3.71 U8.5 | U6.4 33.02,32.37 v33.02,30.73 | U5.4 30.7,14.89 v30.73,14.86 | R20.1 66.42,21.97 67.49,23.04 U$1.D17 | X2.3 51.44,31.24 v50.93,30.73
  Bottom 0.152: U$1.D17 67.49,29.41 66.17,30.73 v50.93,30.73 v33.02,30.73 31.88,30.73 30.73,29.59 v30.73,14.86 30.73,3.75 v30.67,3.68
MDNEG
  Top 0.152: R42.2 77.27,60.63 R7.1 74.28,60.23 R40.1 70.73,61.34 47.86,61.34 46.61,60.09 46.61,50.8 45.72,49.91 U7.6 40.81,49.92 39.45,48.55 R8.1
N$1
  Top 0.152: U11.4 84.16,36.62 TRIGR.P$1
N$2
  Top 0.508: D6.A 6.62,40.49 7.38,41.26 J9.1 7.38,41 8.89,39.5 21.08,39.5 21.54,39.04 U15.2
N$3
  Top 0.508: U2.3 I5V.1
N$4
  Top 0.508: I3V3.1 40.83,25.77 U$1.3V3_2
N$5
  Top 0.508: C1.+ 10.36,60.71 C2.1
  Bottom 0.508: 15VIN.P$1 23.87,48.39 U3.+ 17.65,48.39 15.24,50.8 15.24,55.88 10.39,60.73 C1.+ 10.28,60.65 5.84,65.09 5.84,78.68 4.29,80.23 U1.1
N$6
  Bottom 0.508: J0.1 5.78,53.39 U3.A1
N$7
  Top 0.152: U9.5 14.78,17.79 16.05,16.52 R44.2
N$9
  Bottom 0.508: J0.2 5.46,48.39 U3.A2
N$10
  Top 0.152: R45.2 6.21,12.08 RV5.3
N$11
  Top 0.152: RV5.2 11.28,11.44 13.19,11.44 14.78,13.03 R44.1
N$13
  Top 0.152: R6.2 37.44,56 37.44,56.01 37.7,56.27 U7.1 U7.2
N$14
  Top 0.152: C16.2 R14.1 39.44,50.39 40.24,51.19 U7.5 | R6.1 33.58,52.97 C16.2 | C16.2 32.9,53.21 31.75,54.36 31.75,57.66 DRIVE.P$1
N$21
  Top 0.152: U13.2 69.47,38.55 69.47,36.83 70.82,35.48 R33.1 75.45,33.91 78.99,33.91 80.67,35.58 R13.2
N$22
  Top 0.152: U12.2 11.68,34.56 C4.2
N$23
  Bottom 0.152: J-SP1.1 50.8,8.89 X1.18
N$24
  Top 0.152: U12.4 11.94,37.1 C4.1
N$26
  Top 0.152: R14.2 33.24,47.44 30.55,47.44 RV4.3
N$27
  Top 0.152: C28.2 96.2,31.72 95.22,32.69 RV1.3 | R28.1 95.79,36.82 RV1.3 | U11.1 86.78,32.69 RV1.3
N$28
  Top 0.152: U10.4 94.18,24.02 R27.2 94.2,26.62 C28.1
N$29
  Top 0.152: U10.2 91.66,12.68 D4.A 90.97,11.99 R21.2
N$32  (via drill 0.35)
  Top 0.152: R15.2 28.18,60.27 MDRIVE.P$1 | v28.19,45.72 29.46,44.45 40.99,44.45 43.67,47.13 43.67,48.58 | U7.7 43.67,48.58 | C19.1 39.54,46.44 41.67,48.58 43.67,48.58
  Bottom 0.152: v28.19,45.72 28.19,60.08 MDRIVE.P$1
N$33
  Top 0.152: Q2.1 30.16,79.27 Q6.C 30.66,75.49 32.62,73.53 R35.2
N$34
  Top 0.152: R8.2 37.02,46.5 C19.2
N$35
  Top 0.152: J6.2 96.1,43.17 R28.2
N$36
  Top 0.152: Q3.1 41.06,79.38 Q7.C 41.67,75.49 43.64,73.52 R36.2
N$37
  Top 0.152: Q4.1 52,79.52 Q8.C 52.53,75.68 54.53,73.67 54.53,72.01 54.56,71.98 R37.2
N$38
  Top 0.152: Q5.1 62.82,79.55 Q9.C 63.36,75.58 65.39,73.55 R38.2
N$39
  Top 0.152: R15.1 28.21,67.35 R35.1 34.4,67.35 37.02,69.98 39.24,69.98 40.97,68.24 R36.1 46.18,68.24 47.79,69.85 50.29,69.85 51.9,68.24 R37.1 56.98,68.24 58.58,69.85 60.99,69.85 62.47,68.37 R38.1
N$40
  Top 0.152: Q6.E 35.24,73.39 33.84,71.99 R10.1
N$41
  Top 0.152: Q7.E 46.14,73.12 45.65,72.63 R12.1
N$42
  Top 0.152: Q8.E 57.08,73.64 56.28,72.85 R26.1
N$43
  Top 0.152: Q6.B 35.82,78.61 38.24,78.61
  Top 1.905: R22.2 38.24,78.61 38.24,82.28 Q2.3
N$44
  Top 0.152: R32.1 67.21,72.72 67.9,73.42 Q9.E
N$45
  Top 0.152: Q7.B 46.85,78.74 49.04,78.74
  Top 1.905: R23.2 49.04,78.74 49.04,82.28 Q3.3
N$46
  Top 0.152: Q8.B 57.47,78.61 59.83,78.61
  Top 1.905: R24.2 59.83,78.61 59.83,82.28 Q4.3
N$47
  Top 0.152: Q9.B 68.52,78.74 70.75,78.74
  Top 1.905: R25.2 70.75,78.74 70.75,82.21 Q5.3
N$48
  Top 0.152: RV3.2 65.03,57.4 71.82,57.4 R40.2
N$49
  Top 0.152: R17.1 79.17,80.53 79.17,60.24 78.61,59.69 75.64,59.69 R7.2 74.43,58.99 57.55,58.99 R16.2
  Top 1.905: R17.1 76.84,81 D3.2 76.84,68.21 73.8,65.16 70.75,65.16 | 49.02,65.16 38.24,65.16 R22.1 | 49.02,65.16 59.61,65.16 | 59.61,65.16 70.75,65.16 | R23.1 49.04,65.18 49.02,65.16 | R25.1 70.75,65.16 | R24.1 59.83,65.38 59.61,65.16
  Bottom 1.905: R22.1 38.24,65.09 49.04,65.09 | 49.04,65.09 59.83,65.09 | 59.83,65.09 70.8,65.09 70.8,68.05 R25.1 | R24.1 59.83,65.09 | R23.1 49.04,65.09
N$50
  Bottom 1.905: 68.25,78.62 92.76,78.62 92.72,78.65 D5.2 | 68.25,78.62 57.07,78.62 | 57.07,78.62 46.91,78.62 | 46.91,78.62 35.73,78.62 Q2.2 | 46.91,78.62 46.53,79 Q3.2 | Q4.2 57.32,78.88 57.07,78.62 | Q5.2 68.12,78.75 68.25,78.62
N$51
  Top 0.152: R16.1 57.55,54.63 56.65,53.73 U7.12
N$52
  Top 0.152: U7.14 U7.13 48.59,55 47.88,54.29 47.88,47.75 48.96,46.67 48.96,42.07 R9.1
N$53
  Top 1.905: D5.1 90.19,75.43 F1.1A 95.27,75.43 D5.3
  Top 2.54: F1.1B F1.1A
  Bottom 1.905: F1.1A 95.27,75.43 D5.3
N$54
  Top 2.54: F1.2A F1.2B 86.32,59.68 J8.1
  Bottom 2.54: J8.1 86.32,59.68 F1.2B
N$55
  Top 0.152: R34.1 R31.2 74.51,36.83 70.99,36.83 70.76,37.06 U13.3
N$58
  Top 0.152: U13.8 68.16,43.71 RV2.3
N$59
  Top 0.152: RV2.1 68.16,38.63 U13.1
N$60
  Top 0.152: U7.9 U7.8 49.82,45.54 R5.2
N$62
  Top 0.152: R42.1 77.3,52.49 Q10.3
N$63
  Top 0.152: Q10.2 75.73,49.74 74.45,51.03 R41.1 | R41.1 71.7,51.2 D1.C | R41.1 69.51,53.39 C30.-
ONOFF-BTN
  Top 0.152: X1.2 72.82,14.57 72.82,26.79 U$1.D19
ONOFF-FB
  Bottom 0.152: X1.3 65.49,18.5 63.6,18.5 62.41,19.69 U$1.D15
RTC-MFP
  Top 0.152: U8.7 61.06,6.25 62.41,4.9 U$1.A0
RTCX1
  Top 0.152: U8.1 20.55,7.52 19.73,6.71 Y1.1 15.56,7.06 C22.1
RTCX2
  Top 0.152: U8.2 22.61,6.25 20.92,4.56 Y1.2 19.22,4.4 C23.1
SLCD-CS
  Bottom 0.152: X1.13 54.49,16.8 52.7,16.8 52.15,16.25 52.15,4.16 U$1.D3
SLCD-DC
  Bottom 0.152: X1.14 55.88,11.22 61.2,5.9 61.2,3.4 60.4,2.6 58.2,2.6 57.33,3.47 U$1.D1
SLCD-RST
  Bottom 0.152: X1.15 54.6,14.15 54.6,11.3 59.87,6.03 U$1.D0
SPI-CLK
  Bottom 0.152: X1.11 58.42,16.81 57.25,17.98 47.02,17.98 42.09,13.05 U$1.D7
SPI-MO
  Bottom 0.152: X1.12 57.1,14.19 57.1,16.38 56.28,17.2 47.8,17.2 46.7,16.1 46.7,4.53 U$1.D5
TEMP-SENSE
  Bottom 0.152: U4.3 26.84,75.76 30.2,72.4 30.2,64.87 31.87,63.2 79.4,63.2 81.4,61.2 81.4,9.2 77.65,5.45 U$1.A6
TRG-NEG
  Top 0.152: R21.1 88.48,9.32 55.08,9.32 53.34,11.06 X1.16
TRG-POS
  Top 0.152: U10.1 89.12,12.47 D4.C 89.29,11.6 90.02,10.88 90.02,8.8 89.59,8.37 52.25,8.37 49.6,11.03 49.6,13.71 50.8,14.9 X1.17
TRIGGER-IN
  Top 0.152: U11.3 85.78,34.91 85.47,34.59 85.47,33.33 85.15,33.01 U11.6 85.15,33.01 R29.1 90.37,28.08 92.71,30.42 94.74,30.42 95.12,30.04 95.12,25.59 96.08,24.64 96.08,11.29 91.96,7.18 73.14,7.18 U$1.A3
U13-O
  Top 0.152: R13.1 80.67,43.99 78.43,46.23 71.5,46.23 70.76,45.49 U13.6 70.76,45.57 65.19,51.14 R11.2 49.87,51.14 U7.10
U15IN
  Top 0.152: R1.2 63.71,3.14 61.9,1.33 12.76,1.33 5.84,8.26 2.54,8.26 1.73,9.07 1.73,37.85 2.23,38.35 18.17,38.35 U15.1
VS-BTN
  Bottom 0.152: X1.10 61.46,12.87 62.2,13.61 62.2,16.5 59.87,18.83 U$1.D14
VS-EXT
  Bottom 0.152: X1.9 58.9,17.47 58.9,25.47 U$1.D13
VS-NEG  (via drill 0.35)
  Top 0.152: R33.2 73.87,30.06 v73.91,30.48
  Bottom 0.152: v73.91,30.48 73.79,14.99 73.03,14.22 64.69,14.22 X1.7
VS-POS  (via drill 0.35)
  Top 0.152: R34.2 77.37,31.14 v76.33,30.61
  Bottom 0.152: v76.33,30.61 76.2,11.68 74.87,10.35 65.85,10.35 63.5,12.7 X1.8
VSENSE
  Top 0.152: C15.1 29.69,36.2 U6.1 33.04,36.85 36.12,39.93 R43.1 38.52,40.55 43.43,45.46 R5.1

### Text on the board
tPlace: - | LOAD | + | Current Null | Divider Calibr. | V-SENSE | VSens Calibr. | Trigger Btn | Pulse Width | Trigger | Ref. Voltage | E Load / Version 1.5 / Inspired from Scullcom
tNames: -2.5V